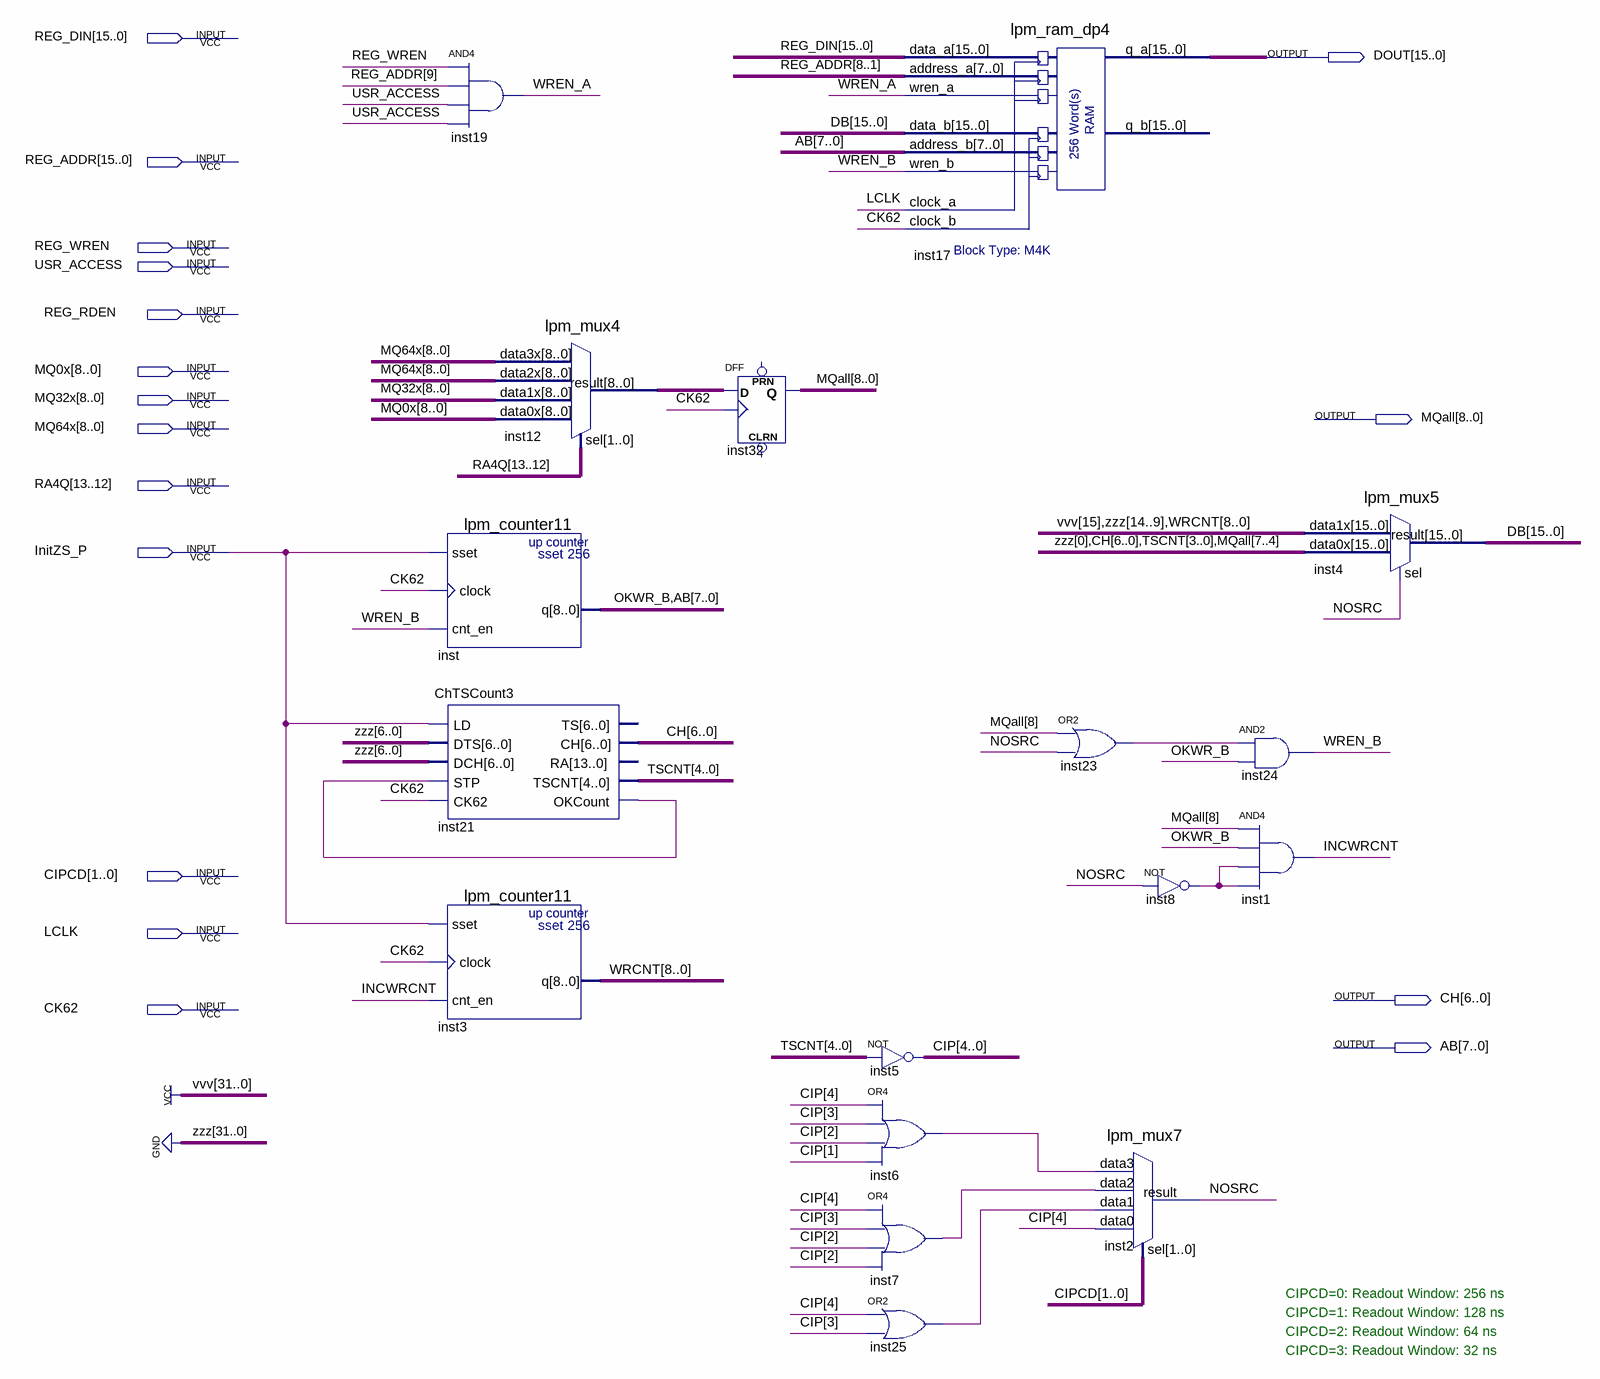
[diagram p0: schematic sheet]
// Quartus schematic ZeroSuppr3.bdf as structural Verilog: 17 symbols, 17 pins
module ZeroSuppr3 (
  input  [15:0] REG_DIN,
  input  [15:0] REG_ADDR,
  input  REG_WREN,
  input  USR_ACCESS,
  input  REG_RDEN,
  input  [8:0] MQ0x,
  input  [8:0] MQ32x,
  input  [8:0] MQ64x,
  input  [13:12] RA4Q,
  input  InitZS_P,
  input  [1:0] CIPCD,
  input  LCLK,
  input  CK62,
  output [15:0] DOUT,
  output [8:0] MQall,
  output [6:0] CH,
  output [7:0] AB
);

  wire INCWRCNT, inst6_out, inst7_out, inst8_out, inst21_okcount, inst23_out, inst25_out, NOSRC, OKWR_B,
       WREN_A, WREN_B;
  wire [4:0] CIP, TSCNT;
  wire [8:0] inst12_result, WRCNT;
  wire [15:0] DB;

  and inst19 (WREN_A, REG_WREN, REG_ADDR[9], USR_ACCESS, USR_ACCESS);
  lpm_mux4 inst12 (.data3x(MQ64x), .data2x(MQ64x), .data1x(MQ32x), .data0x(MQ0x), .sel(RA4Q), .result(inst12_result));
  lpm_counter11 inst (.sset(InitZS_P), .clock(CK62), .cnt_en(WREN_B), .q({OKWR_B, AB}));
  ChTSCount3 inst21 (
    .LD(InitZS_P), .DTS({7{1'b0}}), .DCH({7{1'b0}}), .STP(inst21_okcount), .CK62(CK62), .CH(CH),
    .TSCNT(TSCNT), .OKCount(inst21_okcount));  // open: TS, RA
  lpm_counter11 inst3 (.sset(InitZS_P), .clock(CK62), .cnt_en(INCWRCNT), .q(WRCNT));
  DFF inst32[8:0] (.CLK(CK62), .D(inst12_result), .Q(MQall));  // open: CLRN, PRN
  assign CIP = ~TSCNT;  // NOT inst5, 5 bits wide
  or inst6 (inst6_out, CIP[4], CIP[3], CIP[2], CIP[1]);
  or inst7 (inst7_out, CIP[4], CIP[3], CIP[2], CIP[2]);
  or inst25 (inst25_out, CIP[4], CIP[3]);
  lpm_ram_dp4 inst17 (
    .data_a(REG_DIN), .address_a(REG_ADDR[8:1]), .wren_a(WREN_A), .data_b(DB), .address_b(AB),
    .wren_b(WREN_B), .clock_a(LCLK), .clock_b(CK62), .q_a(DOUT));  // open: q_b
  or inst23 (inst23_out, MQall[8], NOSRC);
  lpm_mux7 inst2 (
    .data3(inst6_out), .data2(inst7_out), .data1(inst25_out), .data0(CIP[4]), .sel(CIPCD), .result(NOSRC));
  not inst8 (inst8_out, NOSRC);
  and inst24 (WREN_B, inst23_out, OKWR_B);
  and inst1 (INCWRCNT, MQall[8], OKWR_B, inst8_out, inst8_out);
  lpm_mux5 inst4 (.data1x({7'b1000000, WRCNT}), .data0x({1'b0, CH, TSCNT[3:0], MQall[7:4]}), .sel(NOSRC), .result(DB));

  // Notes on the sheet:
  //   CIPCD=0: Readout Window: 256 ns
  //   CIPCD=1: Readout Window: 128 ns
  //   CIPCD=2: Readout Window: 64 ns
  //   CIPCD=3: Readout Window: 32 ns
endmodule
